# EAGLE schematic mux-break (EAGLE 6.5.0)
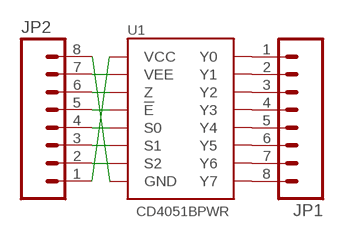
[diagram p0: schematic, sheet 1]

## Parts
JP1  M08SILK_FEMALE_PTH  [1X08]
JP2  M08SILK_FEMALE_PTH  [1X08]
U1  CD4051BPWR  [TSSOP-16]

## Nets
N$1: JP1.1 U1.P$13(Y0)
N$2: JP1.2 U1.P$14(Y1)
N$3: JP1.3 U1.P$15(Y2)
N$4: JP1.4 U1.P$12(Y3)
N$5: JP1.5 U1.P$1(Y4)
N$6: JP1.6 U1.P$5(Y5)
N$7: JP1.7 U1.P$2(Y6)
N$8: JP1.8 U1.P$4(Y7)
N$9: JP2.8 U1.P$8(GND)
N$10: JP2.2 U1.P$9(S2)
N$11: JP2.3 U1.P$10(S1)
N$12: JP2.4 U1.P$11(S0)
N$13: JP2.5 U1.P$6(!E)
N$14: JP2.6 U1.P$3(Z)
N$15: JP2.7 U1.P$7(VEE)
N$16: JP2.1 U1.P$16(VCC)

## Library data of the parts
JP1 JP2 = SparkFun-Connectors:M08: Header 8 Standard 8-pin 0.1" header. Use with straight break away headers (SKU : PRT-00116), right angle break away headers (PRT-00553), swiss pins (PRT-00743), machine pins (PRT-00117), and female headers (PRT-00115).; PROD_ID: CONN-08438
U1 = butter:CD4051BPWR: CD4051BPWR TI 8:1 Analog Multiplexer Digikey <http://www.digikey.com/product-detail/en/CD4051BPWR/296-11993-1-ND/390442>